# Altium schematic sheet Connectors.SchDoc: FER_TEMPLATE
size A4; Author: Leon Baždar; CompanyName: FER; Address1: Zagreb; SheetNumber: 4; SheetTotal: 7
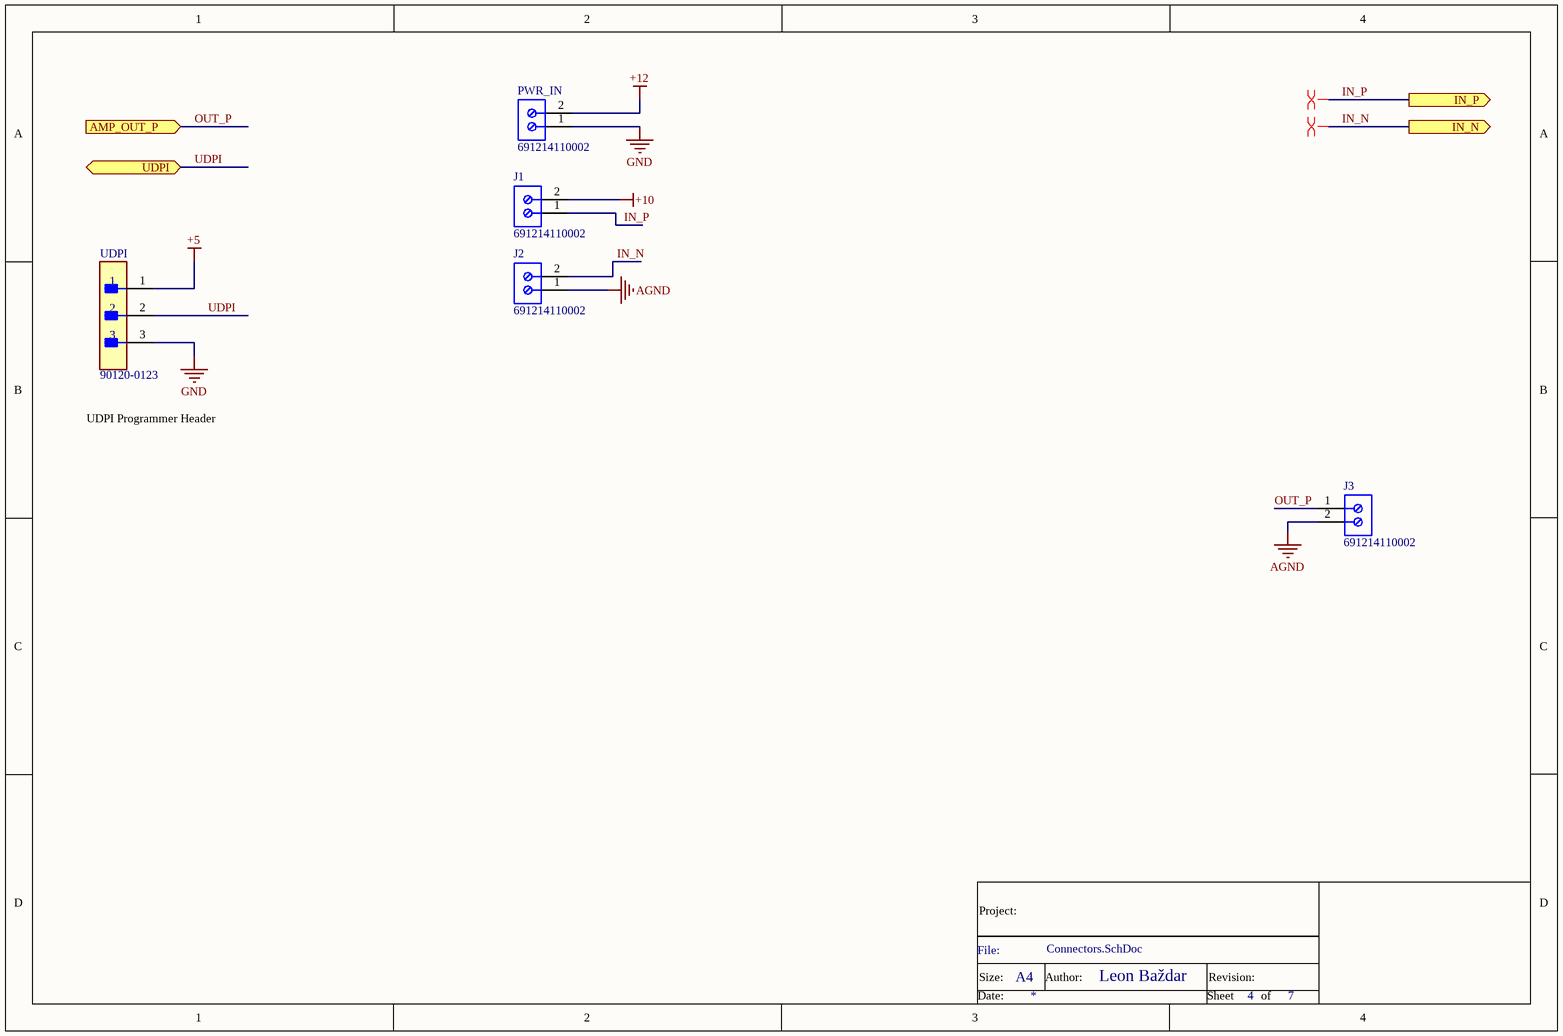
[diagram p0: Connectors.SchDoc]

## Parts
J1  691214110002  [691214110002]
J2  691214110002  [691214110002]
J3  691214110002  [691214110002]
PWR_IN  691214110002  [691214110002]
UDPI  90120-0123  [FP-90120-0123-MFG]

## Ports
AMP_OUT_P (in), IN_N (out), IN_P (out), UDPI (bidir)

## Nets
+5: UDPI.1
+10: J1.2
+12: PWR_IN.2
AGND: J2.1 J3.2
GND: PWR_IN.1 UDPI.3
IN_N: J2.2 ; port IN_N
IN_P: J1.1 ; port IN_P
OUT_P: J3.1 ; port AMP_OUT_P
UDPI: UDPI.2 ; port UDPI

## Layout directives
differential pair: IN_N, IN_P

## Notes on the sheet
- UDPI Programmer Header
- Project:
- File:
- Size:
- A4
- Author:
- Revision:
- Date:
- Sheet
- of

## Library data of the parts
J1-J3 PWR_IN = CMP-1502-02464-1: Serie 2141 - 3.50 mm Horizontal Entry Modular with Rising Cage Clamp WR-TBL, 2 pin; Manufacturer: Wurth Elektronik; Pin Number: 2; Pitch: 3.50mm; Datasheet URL: http://katalog.we-online.de/em/datasheet/6912141100xx.pdf; Packaging: Box; Mounting Technology: THT; Package Reference: 691214110002; Manufacturer URL: http://www.we-online.de; Part Number: 691214110002; Publisher: WurthElektronik; Operating Temperature: -40to105degC
UDPI = CMP-04776-000237-1: CONN HEADER VERT 3POS 2.54MM; Number of Circuits: 3; Max Voltage Rating (DC): 350.35kV; Contact Resistance: 20mR; Gender: Male; Voltage Rating (AC): 350V; Glow Wire Compliant: Non-compliant; Current Rating: 3A; Contact Post Length: 2.9mm; Number of Contacts: 3; Number of Rows: 1; Max Operating Temperature: 125°C; Orientation: Vertical; Number of Positions: 3; Packaging: Tray; Contact Mating Length: 6.75mm; Housing Color: Black; Termination: Solder; Contact Material: Brass; Radiation Hardening: No; Lead Free: Lead Free; Pitch: 2.54mm; RoHS Compliant: Yes; Voltage Rating: 350V; Contact Plating: Tin; Color: Black; Min Operating Temperature: -55°C; Mount: Through Hole; Housing Material: Polyester; Series: 90120; Contact Gender: Male; REACH SVHC: No SVHC